# EAGLE design Rotary_Switch_Breakout (EAGLE 6.5.0)
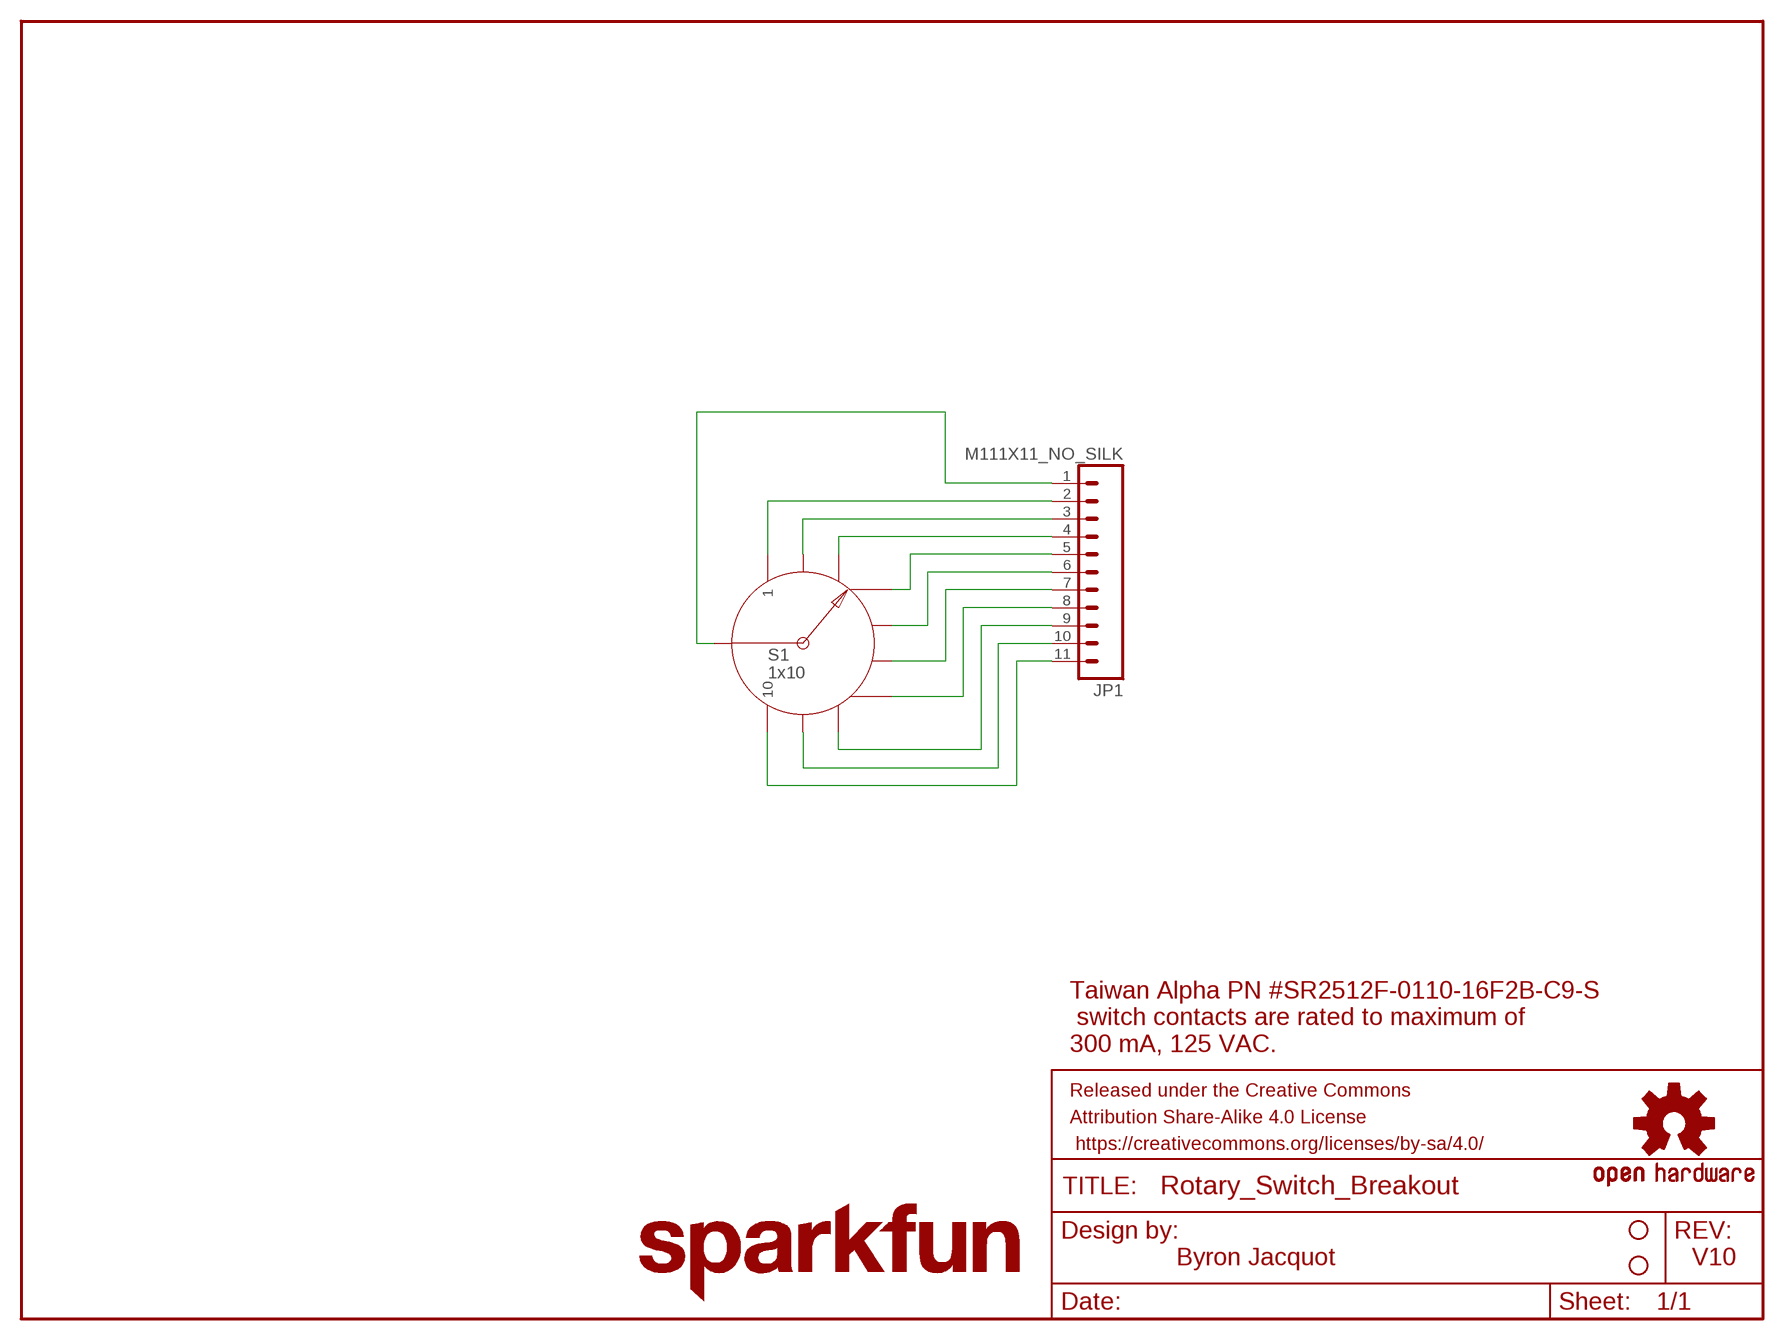
[diagram p0: schematic, sheet 1]

## Parts
FRAME1  FRAME-LETTER  [CREATIVE_COMMONS]
JP1  M111X11_NO_SILK  [1X11_NO_SILK]
LOGO1  OSHW-LOGOM  [OSHW-LOGO-M]
LOGO3  SFE_LOGO_NAME.1_INCH  [SFE_LOGO_NAME_.1]
S1  1x10  SWITCH_ROTARY_1X10KIT  [ROTARY_SWITCH_1X10_KIT]
STANDOFF2  STAND-OFF  [STAND-OFF]
STANDOFF4  STAND-OFF  [STAND-OFF]

## Nets
N$1: JP1.1 S1.COMMON
N$2: JP1.2 S1.1
N$3: JP1.3 S1.2
N$4: JP1.4 S1.3
N$5: JP1.5 S1.4
N$6: JP1.6 S1.5
N$7: JP1.7 S1.6
N$8: JP1.8 S1.7
N$9: JP1.9 S1.8
N$10: JP1.10 S1.9
N$11: JP1.11 S1.10

## Notes on the sheet
- Taiwan Alpha PN #SR2512F-0110-16F2B-C9-S
   switch contacts are rated to maximum of 
  300 mA, 125 VAC.
- Byron Jacquot | V10

## Library data of the parts
FRAME1 = SparkFun-Aesthetics:FRAME-LETTER: Schematic Frame Standard 8.5x11 US Letter frame
JP1 = SparkFun-Connectors:M11: Header 11 Standard 11-pin 0.1" header. Use with straight break away headers (SKU : PRT-00116), right angle break away headers (PRT-00553), swiss pins (PRT-00743), machine pins (PRT-00117), and female headers (PRT-00115).
LOGO1 = SparkFun-Aesthetics:OSHW-LOGO: Open Source Hardware Logo This logo indicates the piece of hardware it is found on incorporates a OSHW license and/or adheres to the definition of open source hardware found here: http://freedomdefined.org/OSHW
LOGO3 = SparkFun-Aesthetics:SFE_LOGO_NAME: SFE Logo, name only This is the SparkFun name logo. The logo on the schematic will always be the same size; the package variant is the height of the flame part of the logo (or the height the flame would be, if it were drawn). Default layer for the logo on the board is tSilk.
S1 = SparkFun-Electromechanical:SWITCH_ROTARY_1X10: SWCH-12120; PROD_ID: SWCH-12120
STANDOFF2 STANDOFF4 = SparkFun-Electromechanical:STAND-OFF: #4 Stand Off This is the mechanical footprint for a #4 phillips button head screw. Use the keepout ring to avoid running the screw head into surrounding components. SKU : PRT-00447

## Board
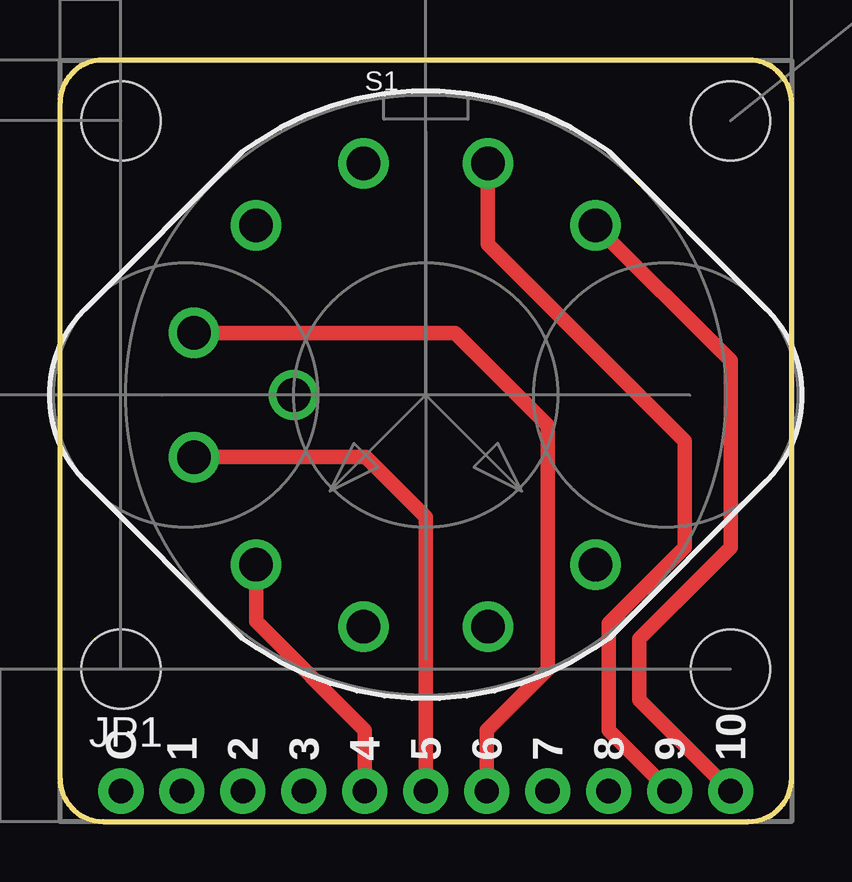
[diagram p1: board, top side]
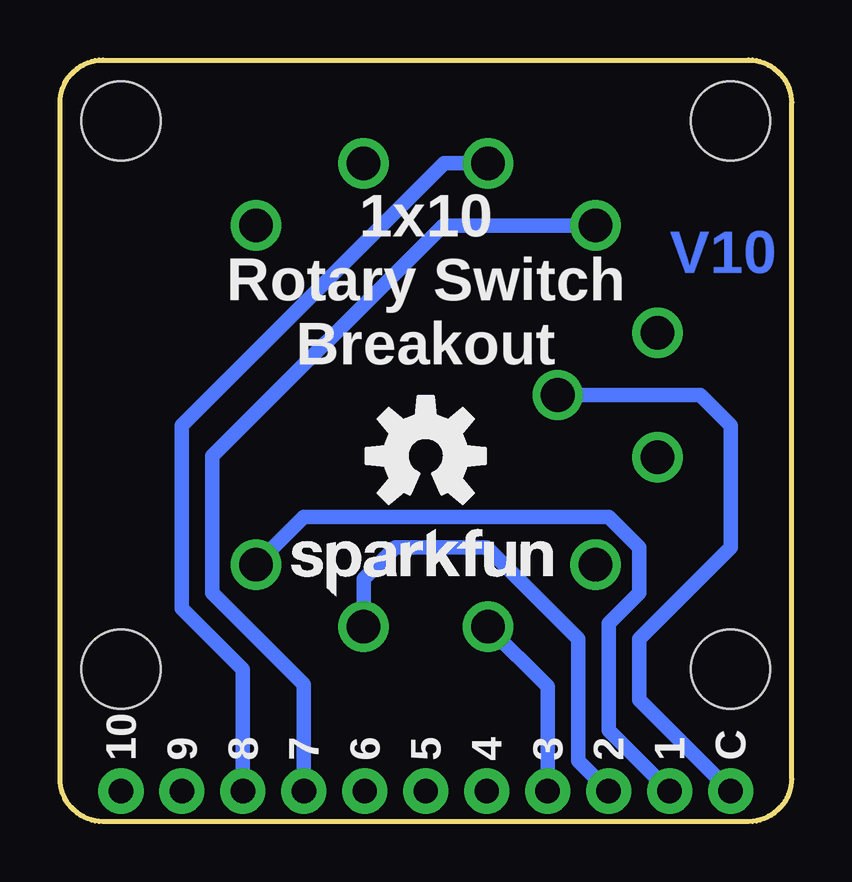
[diagram p2: board, bottom side, seen from below]

Size 30.48 x 31.75 mm. Coordinates in mm from the lower left corner, seen from the top.
Outline: 28.68,31.75 1.8,31.75 arc90 0,29.95 0,1.8 arc90 1.8,0 28.68,0 arc90 30.48,1.8 30.48,29.95 arc90 28.68,31.75
Copper layers (1*16): Top 0.035mm / dielectric 1.5mm / Bottom 0.035mm
Design rules "SparkFun-2-layer": minimum track width 7mil, minimum drill 15mil, track to track 8mil, track to pad 8mil, pad to pad 8mil, via to via 8mil, smd to smd 8mil, copper to edge 8mil, drill to drill 8mil, minimum pad ring 12mil, minimum via ring 10mil, stop-mask expansion 4mil, vias tented up to drill 20mil, thermal gap 10mil

### Footprints (pad centres in the part's own frame; a part is rotated, then mirrored left to right if it is on the bottom)
1X11_NO_SILK = drill 1.016 pad 1.88: 1 0,0; 2 2.54,0; 3 5.08,0; 4 7.62,0; 5 10.16,0; 6 12.7,0; 7 15.24,0; 8 17.78,0; 9 20.32,0; 10 22.86,0; 11 25.4,0
ROTARY_SWITCH_1X10_KIT = drill 1.4: 1 7.071,7.071; 2 9.659,2.588; 3 9.659,-2.588; 4 7.071,-7.071; 5 2.588,-9.659; 6 -2.588,-9.659; 7 -7.071,-7.071; 8 -9.659,-2.588; 9 -9.659,2.588; 10 -7.071,7.071; COMMON 0,-5.5
STAND-OFF = hole 3.302: 0,0

### Placement (x,y rotation side)
FRAME1  0,-7.62 0 top  (outside the outline)
JP1  2.54,1.27 0 top
LOGO1  15.24,15.24 0 bottom
LOGO3  21.34,8.89 0 bottom
S1  15.24,17.78 270 top
STANDOFF1  STAND-OFF  [STAND-OFF]  2.54,29.21 0 top
STANDOFF2  27.94,29.21 0 top
STANDOFF3  STAND-OFF  [STAND-OFF]  2.54,6.35 0 top
STANDOFF4  27.94,6.35 0 top

### Tracks (layer width: path | path; a pad name or v marks a point on that pad's centre or on a via)
N$1
  Bottom 0.61: JP1.1 6.35,5.08 6.35,7.62 2.54,11.43 2.54,16.51 3.81,17.78 S1.COMMON
N$2
  Bottom 0.61: JP1.2 7.62,3.81 7.62,8.26 6.35,9.53 6.35,11.43 7.62,12.7 20.32,12.7 S1.1
N$3
  Bottom 0.61: JP1.3 8.89,2.54 8.89,7.62 12.7,11.43 16.51,11.43 17.83,10.11 S1.2
N$4
  Bottom 0.61: JP1.4 10.16,5.63 S1.3
N$5
  Top 0.61: JP1.5 12.7,3.81 8.17,8.34 S1.4
N$6
  Top 0.61: S1.5 12.75,15.19 15.24,12.7 JP1.6
N$7
  Top 0.61: JP1.7 17.78,3.81 20.32,6.35 20.32,16.51 16.46,20.37 S1.6
N$8
  Bottom 0.61: S1.7 14.52,24.85 24.13,15.24 24.13,9.53 20.32,5.71 JP1.8
N$9
  Bottom 0.61: JP1.9 22.86,6.35 25.4,8.89 25.4,16.51 14.47,27.44 S1.8
N$10
  Top 0.61: JP1.10 22.86,3.81 22.86,8.26 26.04,11.43 26.04,15.88 17.83,24.08 S1.9
N$11
  Top 0.61: JP1.11 24.13,5.08 24.13,7.62 27.94,11.43 27.94,19.22 S1.10

### Text on the board
Bottom: V10
tPlace: C | 1 | 2 | 3 | 4 | 5 | 6 | 7 | 8 | 9 | 10
bPlace: 1x10 / Rotary Switch / Breakout | C | 1 | 2 | 3 | 4 | 5 | 6 | 7 | 8 | 9 | 10
tDocu: 0.125(4-40) | Byron Jacquot